# Altium schematic sheet SCH_V2.SchDoc: Mike
size A3; CompanyName: Exeger AB; Organization: Exeger AB; Address1: Brinellvägen 32; Address3: 114 28 Stockholm; Address4: SWEDEN; Revision: 0.1; SheetNumber: 1; SheetTotal: 1; PageSetup: Record=PageOptions|CenterHorizontal=True|CenterVertical=True|PrintScale=1.01|XCorrection=1.00|YCorrection=1.00|PrintKind=2|BorderSize=5000000|LeftOffset=0|BottomOffset=0|Orientation=2|PaperLength=1000|PaperWidth=1000|Scale=100|PaperSource=7|PrintQuality=-3|MediaType=1|DitherType=10|PrintScaleMode=1|PaperKind=A3|PaperIndex=8
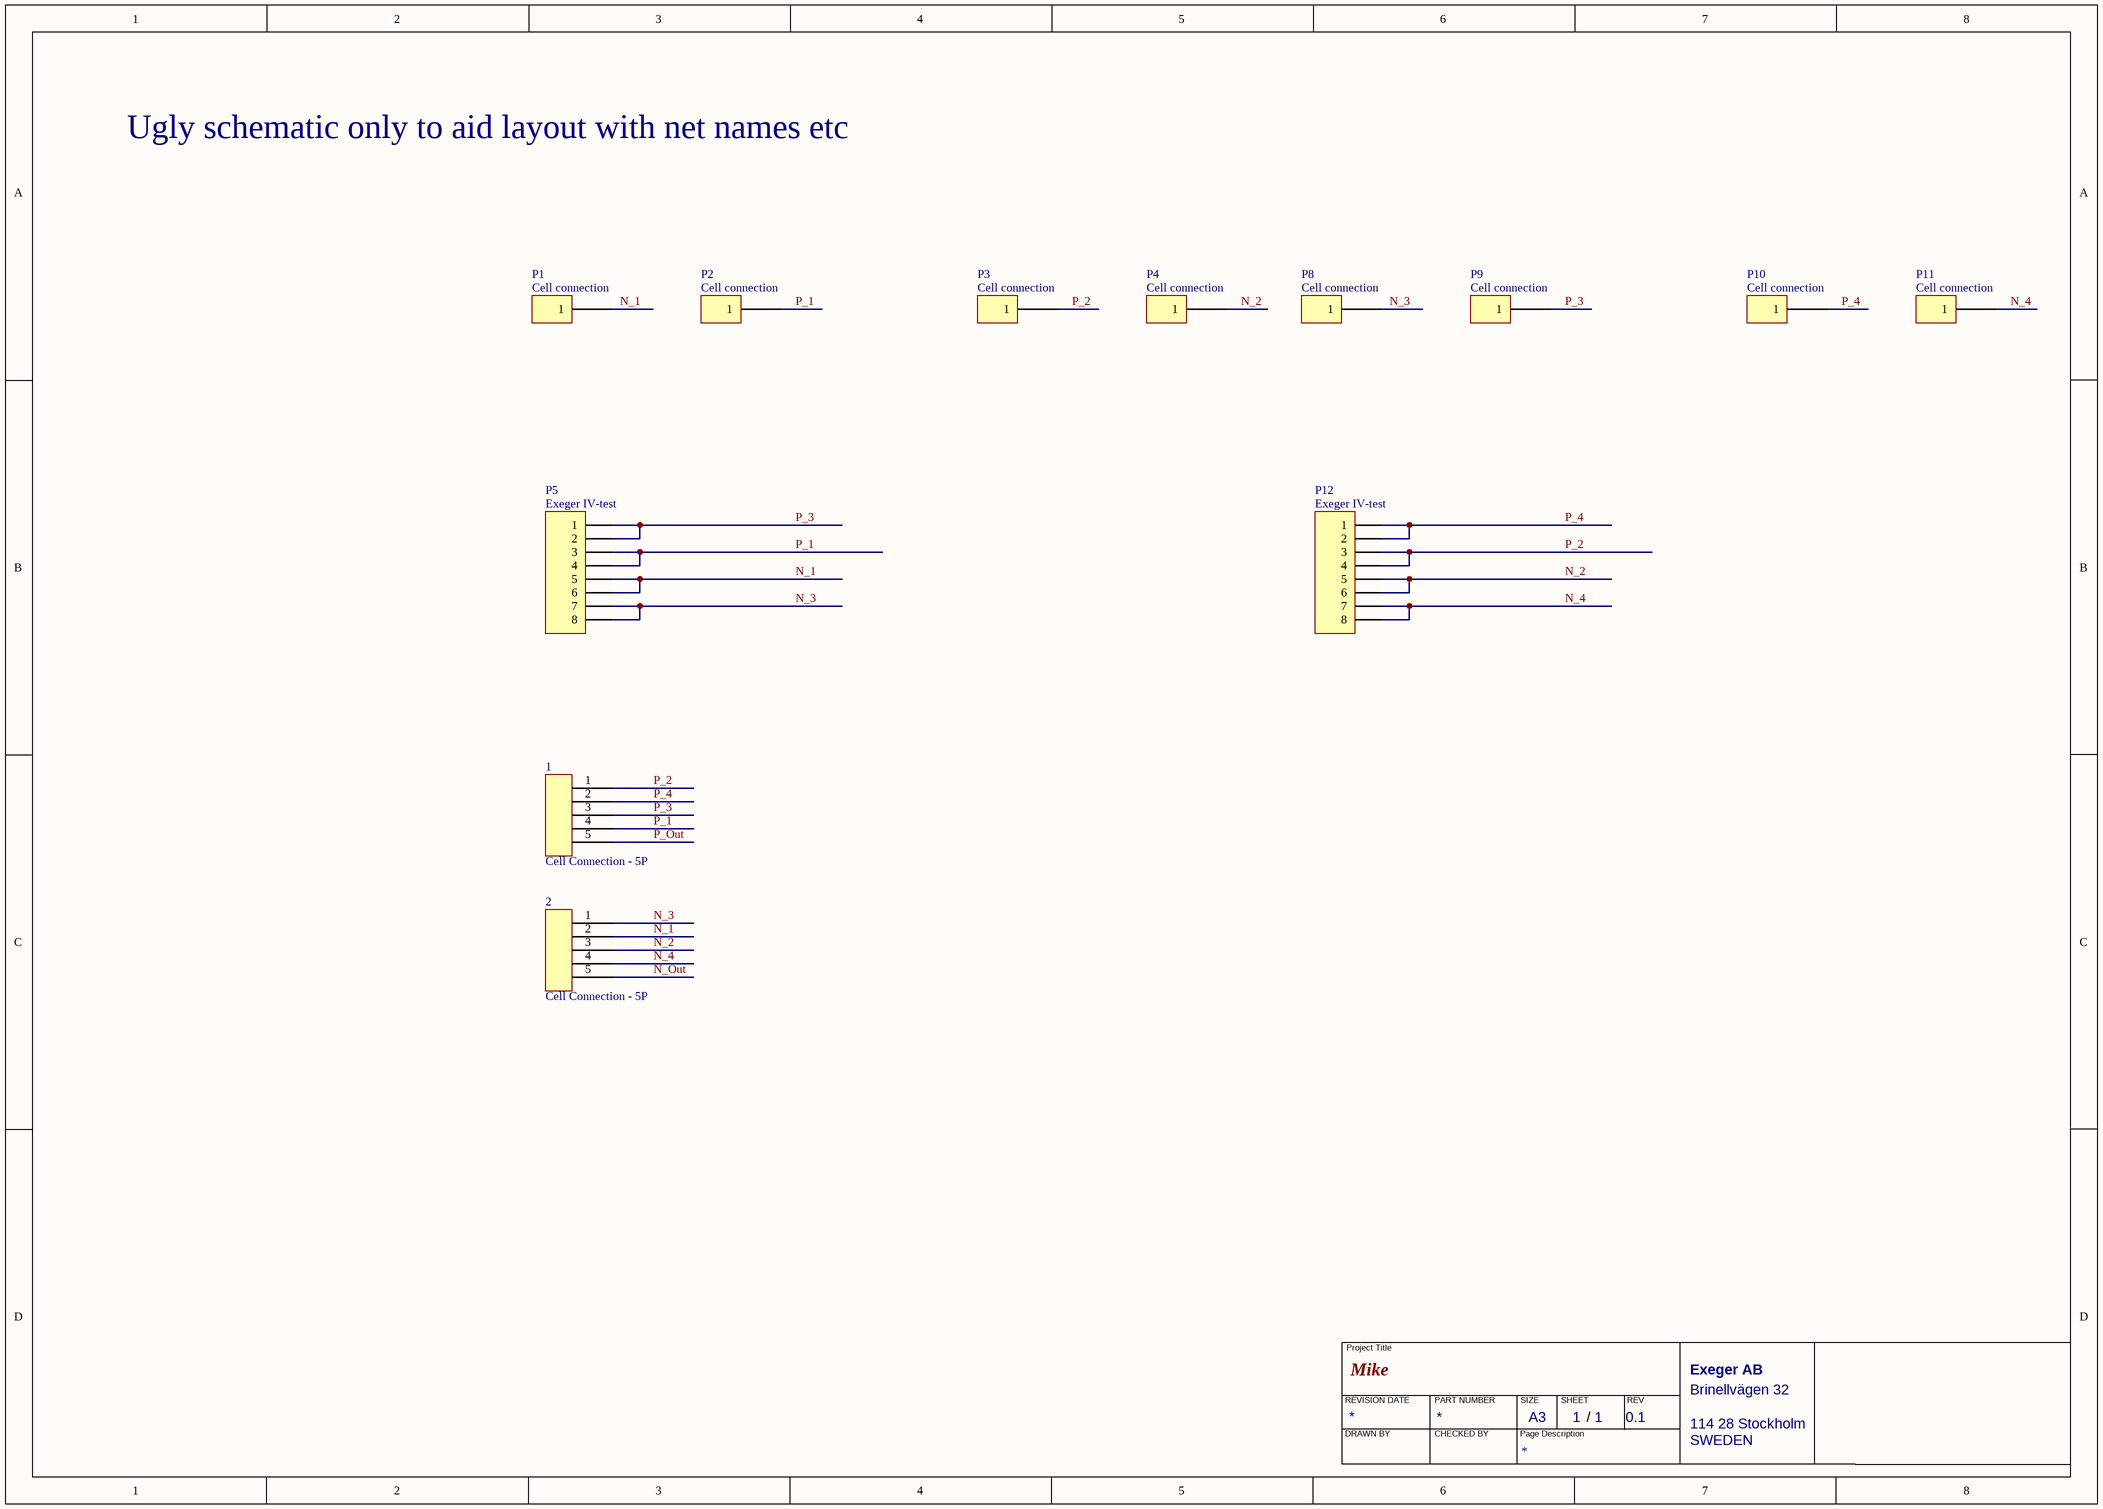
[diagram p0: SCH_V2.SchDoc]

## Parts
1  Cell Connection - 5P  [4-To-1-Connector]
2  Cell Connection - 5P  [4-To-1-Connector]
P1  Cell connection  [Cell_pad_4mm_SM0.5mm]
P2  Cell connection  [Cell_pad_4mm_SM0.5mm]
P3  Cell connection  [Cell_pad_4mm_SM0.5mm]
P4  Cell connection  [Cell_pad_4mm_SM0.5mm]
P5  Exeger IV-test  [EXEGER_IV_8_PIN_NO_STIFF_ISOL_0.4]
P8  Cell connection  [Cell_pad_4mm_SM0.5mm]
P9  Cell connection  [Cell_pad_4mm_SM0.5mm]
P10  Cell connection  [Cell_pad_4mm_SM0.5mm]
P11  Cell connection  [Cell_pad_4mm_SM0.5mm]
P12  Exeger IV-test  [EXEGER_IV_8_PIN_NO_STIFF_ISOL_0.4]

## Nets
N_1: 2.2 P1.1 P5.5 P5.6
N_2: 2.3 P4.1 P12.5 P12.6
N_3: 2.1 P5.7 P5.8 P8.1
N_4: 2.4 P11.1 P12.7 P12.8
N_Out: 2.5
P_1: 1.4 P2.1 P5.3 P5.4
P_2: 1.1 P3.1 P12.3 P12.4
P_3: 1.3 P5.1 P5.2 P9.1
P_4: 1.2 P10.1 P12.1 P12.2
P_Out: 1.5

## Notes on the sheet
- Ugly schematic only to aid layout with net names etc
- Project Title
- DRAWN BY
- REVISION DATE
- PART NUMBER
- CHECKED BY
- Page Description
- SIZE
- A3
- SHEET
- /
- REV

## Library data of the parts
P1-P4 P8-P11 = Cell connection 1P
P5 P12 = Header 8: Header, 8-Pin